# Altium schematic sheet DRIVER_2.SchDoc
size A3; SheetNumber: 11; SheetTotal: 14
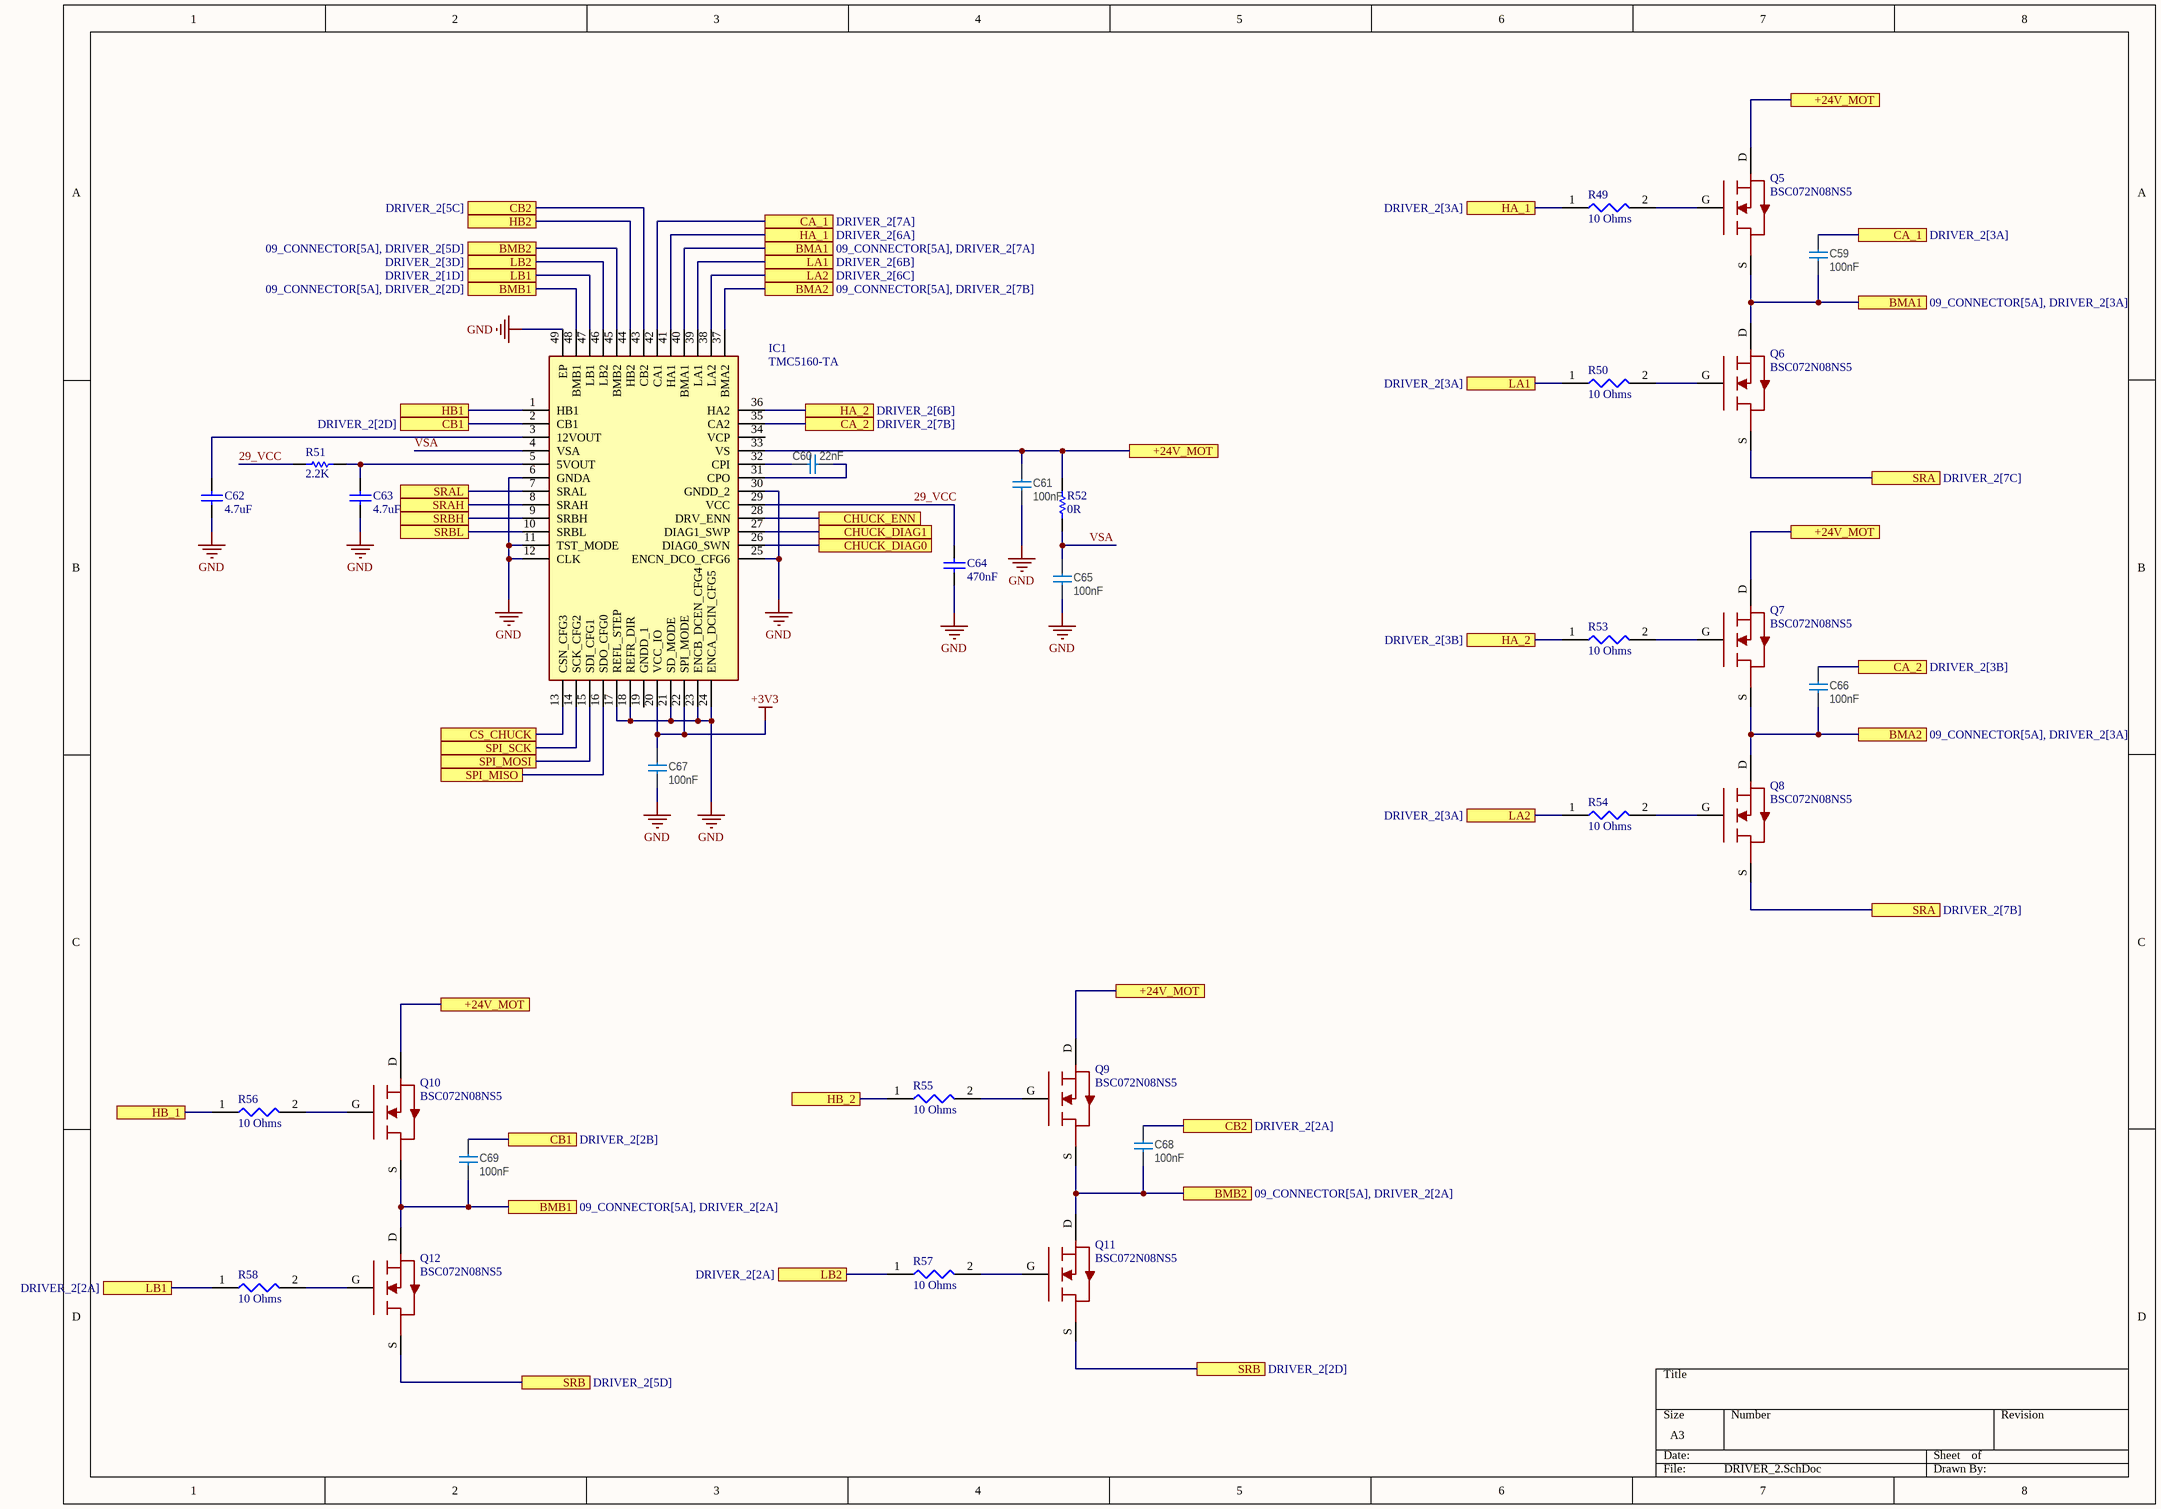
[diagram p0: DRIVER_2.SchDoc]

## Parts
C59  100nF  [CAPC0603X03L_C]
C60  22nF  [CAPC0603X03L_C]
C61  100nF  [CAPC0603X03L_C]
C62  value 4.7uF  [SMC0805]  (hidden comment: CAP CER 4.7UF 50V X5R 0805)
C63  value 4.7uF  [SMC0805]  (hidden comment: CAP CER 4.7UF 50V X5R 0805)
C64  value 470nF  [CAP0402(1005)x0.5]  (hidden comment: CAP CER 0.47UF 10V X5R 0402)
C65  100nF  [CAPC0603X03L_C]
C66  100nF  [CAPC0603X03L_C]
C67  100nF  [CAPC0603X03L_C]
C68  100nF  [CAPC0603X03L_C]
C69  100nF  [CAPC0603X03L_C]
IC1  TMC5160-TA  [QFP50P900X900X120-49N]
Q5  BSC072N08NS5  [BSC080N03LSG]
Q6  BSC072N08NS5  [BSC080N03LSG]
Q7  BSC072N08NS5  [BSC080N03LSG]
Q8  BSC072N08NS5  [BSC080N03LSG]
Q9  BSC072N08NS5  [BSC080N03LSG]
Q10  BSC072N08NS5  [BSC080N03LSG]
Q11  BSC072N08NS5  [BSC080N03LSG]
Q12  BSC072N08NS5  [BSC080N03LSG]
R49  10 Ohms  [RESC1608X55N]
R50  10 Ohms  [RESC1608X55N]
R51  2.2K  [0402_R]
R52  0R  [0402_R]
R53  10 Ohms  [RESC1608X55N]
R54  10 Ohms  [RESC1608X55N]
R55  10 Ohms  [RESC1608X55N]
R56  10 Ohms  [RESC1608X55N]
R57  10 Ohms  [RESC1608X55N]
R58  10 Ohms  [RESC1608X55N]

## Ports
+24V_MOT (see 06_DRIVER[5B], 06_DRIVER[5D], 09_CONNECTOR[2A], 09_CONNECTOR[2B], DRIVER_2[2C], DRIVER_2[5B], DRIVER_2[5C], DRIVER_2[7A]), +24V_MOT (see 06_DRIVER[5B], 06_DRIVER[5D], 09_CONNECTOR[2A], 09_CONNECTOR[2B], DRIVER_2[2C], DRIVER_2[5B], DRIVER_2[5C], DRIVER_2[7B]), +24V_MOT (see 06_DRIVER[5B], 06_DRIVER[5D], 09_CONNECTOR[2A], 09_CONNECTOR[2B], DRIVER_2[2C], DRIVER_2[5B], DRIVER_2[7A], DRIVER_2[7B]), +24V_MOT (see 06_DRIVER[5B], 06_DRIVER[5D], 09_CONNECTOR[2A], 09_CONNECTOR[2B], DRIVER_2[2C], DRIVER_2[5C], DRIVER_2[7A], DRIVER_2[7B]), +24V_MOT (see 06_DRIVER[5B], 06_DRIVER[5D], 09_CONNECTOR[2A], 09_CONNECTOR[2B], DRIVER_2[5B], DRIVER_2[5C], DRIVER_2[7A], DRIVER_2[7B]), BMA1 (see 09_CONNECTOR[5A], DRIVER_2[3A]), BMA1 (see 09_CONNECTOR[5A], DRIVER_2[7A]), BMA2 (see 09_CONNECTOR[5A], DRIVER_2[3A]), BMA2 (see 09_CONNECTOR[5A], DRIVER_2[7B]), BMB1 (see 09_CONNECTOR[5A], DRIVER_2[2A]), BMB1 (see 09_CONNECTOR[5A], DRIVER_2[2D]), BMB2 (see 09_CONNECTOR[5A], DRIVER_2[2A]), BMB2 (see 09_CONNECTOR[5A], DRIVER_2[5D]), CA_1 (see DRIVER_2[3A]), CA_1 (see DRIVER_2[7A]), CA_2 (see DRIVER_2[3B]), CA_2 (see DRIVER_2[7B]), CB1 (see DRIVER_2[2B]), CB1 (see DRIVER_2[2D]), CB2 (see DRIVER_2[2A]), CB2 (see DRIVER_2[5C]), CHUCK_DIAG0, CHUCK_DIAG1, CHUCK_ENN, CS_CHUCK, HA_1 (see DRIVER_2[3A]), HA_1 (see DRIVER_2[6A]), HA_2 (see DRIVER_2[3B]), HA_2 (see DRIVER_2[6B]), HB1, HB2, HB_1, HB_2, LA1 (see DRIVER_2[3A]), LA1 (see DRIVER_2[6B]), LA2 (see DRIVER_2[3A]), LA2 (see DRIVER_2[6C]), LB1 (see DRIVER_2[1D]), LB1 (see DRIVER_2[2A]), LB2 (see DRIVER_2[2A]), LB2 (see DRIVER_2[3D]), SPI_MISO, SPI_MOSI, SPI_SCK, SRA (see DRIVER_2[7B]), SRA (see DRIVER_2[7C]), SRAH, SRAL, SRB (see DRIVER_2[2D]), SRB (see DRIVER_2[5D]), SRBH, SRBL

## Nets
+3V3: C67.2 IC1.20(VCC_IO) IC1.22(SPI_MODE)
GND: C61.1 C62.1 C63.1 C64.1 C65.1 C67.1 IC1.6(GNDA) IC1.11(TST_MODE) IC1.12(CLK) IC1.17(REFL_STEP) IC1.18(REFR_DIR) IC1.21(SD_MODE) IC1.23(ENCB_DCEN_CFG4) IC1.24(ENCA_DCIN_CFG5) IC1.25(ENCN_DCO_CFG6) IC1.30(GNDD_2) IC1.49(EP)
29_VCC: C64.2 IC1.29(VCC) R51.2
+24V_MOT: C61.2 IC1.33(VS) Q5.D Q7.D Q9.D Q10.D R52.2 ; port +24V_MOT
BMA1: C59.1 IC1.40(BMA1) Q5.S Q6.D ; port BMA1
BMA2: C66.1 IC1.37(BMA2) Q7.S Q8.D ; port BMA2
BMB1: C69.1 IC1.48(BMB1) Q10.S Q12.D ; port BMB1
BMB2: C68.1 IC1.45(BMB2) Q9.S Q11.D ; port BMB2
CA_1: C59.2 IC1.42(CA1) ; port CA_1
CA_2: C66.2 IC1.35(CA2) ; port CA_2
CB1: C69.2 IC1.2(CB1) ; port CB1
CB2: C68.2 IC1.43(CB2) ; port CB2
CHUCK_DIAG0: IC1.26(DIAG0_SWN) ; port CHUCK_DIAG0
CHUCK_DIAG1: IC1.27(DIAG1_SWP) ; port CHUCK_DIAG1
CHUCK_ENN: IC1.28(DRV_ENN) ; port CHUCK_ENN
CS_CHUCK: IC1.13(CSN_CFG3) ; port CS_CHUCK
HA_1: IC1.41(HA1) R49.1 ; port HA_1
HA_2: IC1.36(HA2) R53.1 ; port HA_2
HB1: IC1.1(HB1) ; port HB1
HB2: IC1.44(HB2) ; port HB2
HB_1: R56.1 ; port HB_1
HB_2: R55.1 ; port HB_2
LA1: IC1.39(LA1) R50.1 ; port LA1
LA2: IC1.38(LA2) R54.1 ; port LA2
LB1: IC1.47(LB1) R58.1 ; port LB1
LB2: IC1.46(LB2) R57.1 ; port LB2
SPI_MISO: IC1.16(SDO_CFG0) ; port SPI_MISO
SPI_MOSI: IC1.15(SDI_CFG1) ; port SPI_MOSI
SPI_SCK: IC1.14(SCK_CFG2) ; port SPI_SCK
SRA: Q6.S Q8.S ; port SRA
SRAH: IC1.8(SRAH) ; port SRAH
SRAL: IC1.7(SRAL) ; port SRAL
SRB: Q11.S Q12.S ; port SRB
SRBH: IC1.9(SRBH) ; port SRBH
SRBL: IC1.10(SRBL) ; port SRBL
VSA: C65.2 IC1.4(VSA) R52.1
NetC60_1: C60.1 IC1.32(CPI)
NetC60_2: C60.2 IC1.31(CPO)
NetC62_2: C62.2 IC1.3(12VOUT)
NetC63_2: C63.2 IC1.5(5VOUT) R51.1
NetQ5_G: Q5.G R49.2
NetQ6_G: Q6.G R50.2
NetQ7_G: Q7.G R53.2
NetQ8_G: Q8.G R54.2
NetQ9_G: Q9.G R55.2
NetQ10_G: Q10.G R56.2
NetQ11_G: Q11.G R57.2
NetQ12_G: Q12.G R58.2

Not connected (* = marked no-connect by the designer): IC1 19(GNDD_1) 34(VCP)

## Library data of the parts
C59 C61 C65-C69 = C0201-100n: Capacitor, X5R, ±10%; Manufacturer: N.A.; Part number IPS: 00000001248, 00000002505; Part number Norautron: 262071862; Part number NEMS: 100200078; Note: 16V; Pad Count: 2; Component Status: Active; Part Number: C0201-100n; Manufacturer Part Number: N.A.; ComponentLink1URL: N.A.; ComponentLink1Description: Datasheet; ComponentLink2URL: N.A.; ComponentLink2Description: Supplier link; HelpURL: N.A.; Footprint Doc: 0201; LatestRevisionDate: 2017-11-09; Published: 2014-11-13; Value: 100nF; Supplier 1: N.A.; Supplier Part Number 1: N.A.; Supplier 2: N.A.; Supplier Part Number 2: N.A.; Artikkelnr Noca: N.A.; PartId: 100200078; Component Class: Capacitors; Author: rsk
C60 = C0201-22n-10V-X5R-GRM033R61A223KE84_1: Capacitor, Ceramic, 22nF 10V X5R 0201,±10%; Manufacturer: Murata; Manufacturer Part Number: GRM033R61A223KE84D; Part number NEMS: 100200495; Pad Count: 2; Artikkelnr Noca: N.A.; Component Status: Active; Part Number: C0201-22n-10V-X5R-GRM033R61A223KE84; Component Class: Capacitors; Author: prbu; ComponentLink1URL: https://www.murata.com/en-sg/products/productdetail?partno=GRM033R61A223KE84%23; ComponentLink1Description: Datasheet; ComponentLink2URL: https://www.mouser.com/ProductDetail/Murata-Electronics/GRM033R61A223KE84E?qs=BZBei1rCqCCPqziwOnRusw%3D%3D; ComponentLink2Description: Supplier link; HelpURL: N.A.; Footprint Doc: 0201; LatestRevisionDate: 2021-12-09; Published: 2021-12-09; Value: 22nF; Note: 10V; Supplier 1: Mouser; Supplier Part Number 1: 81-GRM033R61A223KE4E; Supplier 2: Digi-Key; Supplier Part Number 2: 490-13334-1-ND; Part number IPS: N.A.; Part number Norautron: N.A.; PartId: 100200495
C62 C63 = CAP0805_4.7UF_50V: 4.7 µF ±10% 50V Ceramic Capacitor X5R 0805 (2012 Metric); Manufacturer Part Number: GRT21BR61H475KE13L; Order Code: DIGI: 490-12394-2-ND
C64 = CAP0402_470NF_10V: 0.47 µF ±10% 10V Ceramic Capacitor X5R 0402 (1005 Metric); Manufacturer Part Number: CL05A474KP5NNNC; Order Code: DIGI: 1276-1173-2-ND; Sirius Stock Code: *; LCSC Part Number: C47339; LCSC Manufacturer Part Number: CL05A474KP5NNNC
IC1 = TMC5160-TA: Integrated Circuit; Manufacturer_Name: Analog Devices; Datasheet Link: https://datasheet.datasheetarchive.com/originals/distributors/DKDS-40/47761.pdf; Height: 1.2mm; Manufacturer_Part_Number: TMC5160-TA; Mouser Part Number: N/A; Mouser Price/Stock: https://www.mouser.co.uk/ProductDetail/ADI-Trinamic/TMC5160-TA?qs=TiOZkKH1s2S%2FryBy%252BZXLdA%3D%3D
Q5-Q12 = BSC072N08NS5: Transistor; Manufacturer_Name: Infineon; Datasheet Link: https://www.infineon.com/dgdl/Infineon-BSC072N08NS5-DS-v02_00-EN.pdf?fileId=5546d4624ad04ef9014ae3d8e8192c7c; Manufacturer_Part_Number: BSC072N08NS5; Mouser Part Number: N/A; Mouser Price/Stock: https://www.mouser.co.uk/ProductDetail/Infineon-Technologies/BSC072N08NS5?qs=eERmAtE5kX0PueJFVqKhsA%3D%3D
R49 R50 R53-R58 = RNCF0603AKT10R0: Resistor; Manufacturer_Name: Stackpole Electronics; Datasheet Link: https://cs.seielect.com/catalog/SEI-RNCF.pdf; Height: 0.55mm; Manufacturer_Part_Number: RNCF0603AKT10R0; Mouser Part Number: 708-RNCF0603AKT10R0; Mouser Price/Stock: https://www.mouser.co.uk/ProductDetail/SEI-Stackpole/RNCF0603AKT10R0?qs=IPgv5n7u5QaEV3NAu4qPaA%3D%3D; Arrow Part Number: RNCF0603AKT10R0; Arrow Price/Stock: https://www.arrow.com/en/products/rncf0603akt10r0/stackpole-electronics?region=nac
R51 = Res1_7: RES 2.2K OHM 1% 1/16W 0402; Manufacturer Part Number: RC0402FR-072K2L; Manufacturer: Yageo; Value: 2.2K; Supplier Part Number: 311-2.20KLRCT-ND
R52 = Res1: RES 0 OHM JUMPER 1/16W 0402; Manufacturer Part Number: RC0402FR-070RL; Manufacturer: Yageo; Value: 0R; Supplier Part Number: 311-0.0LRCT-ND